# EAGLE design KGM LiPower v1.0 (EAGLE 5.11)
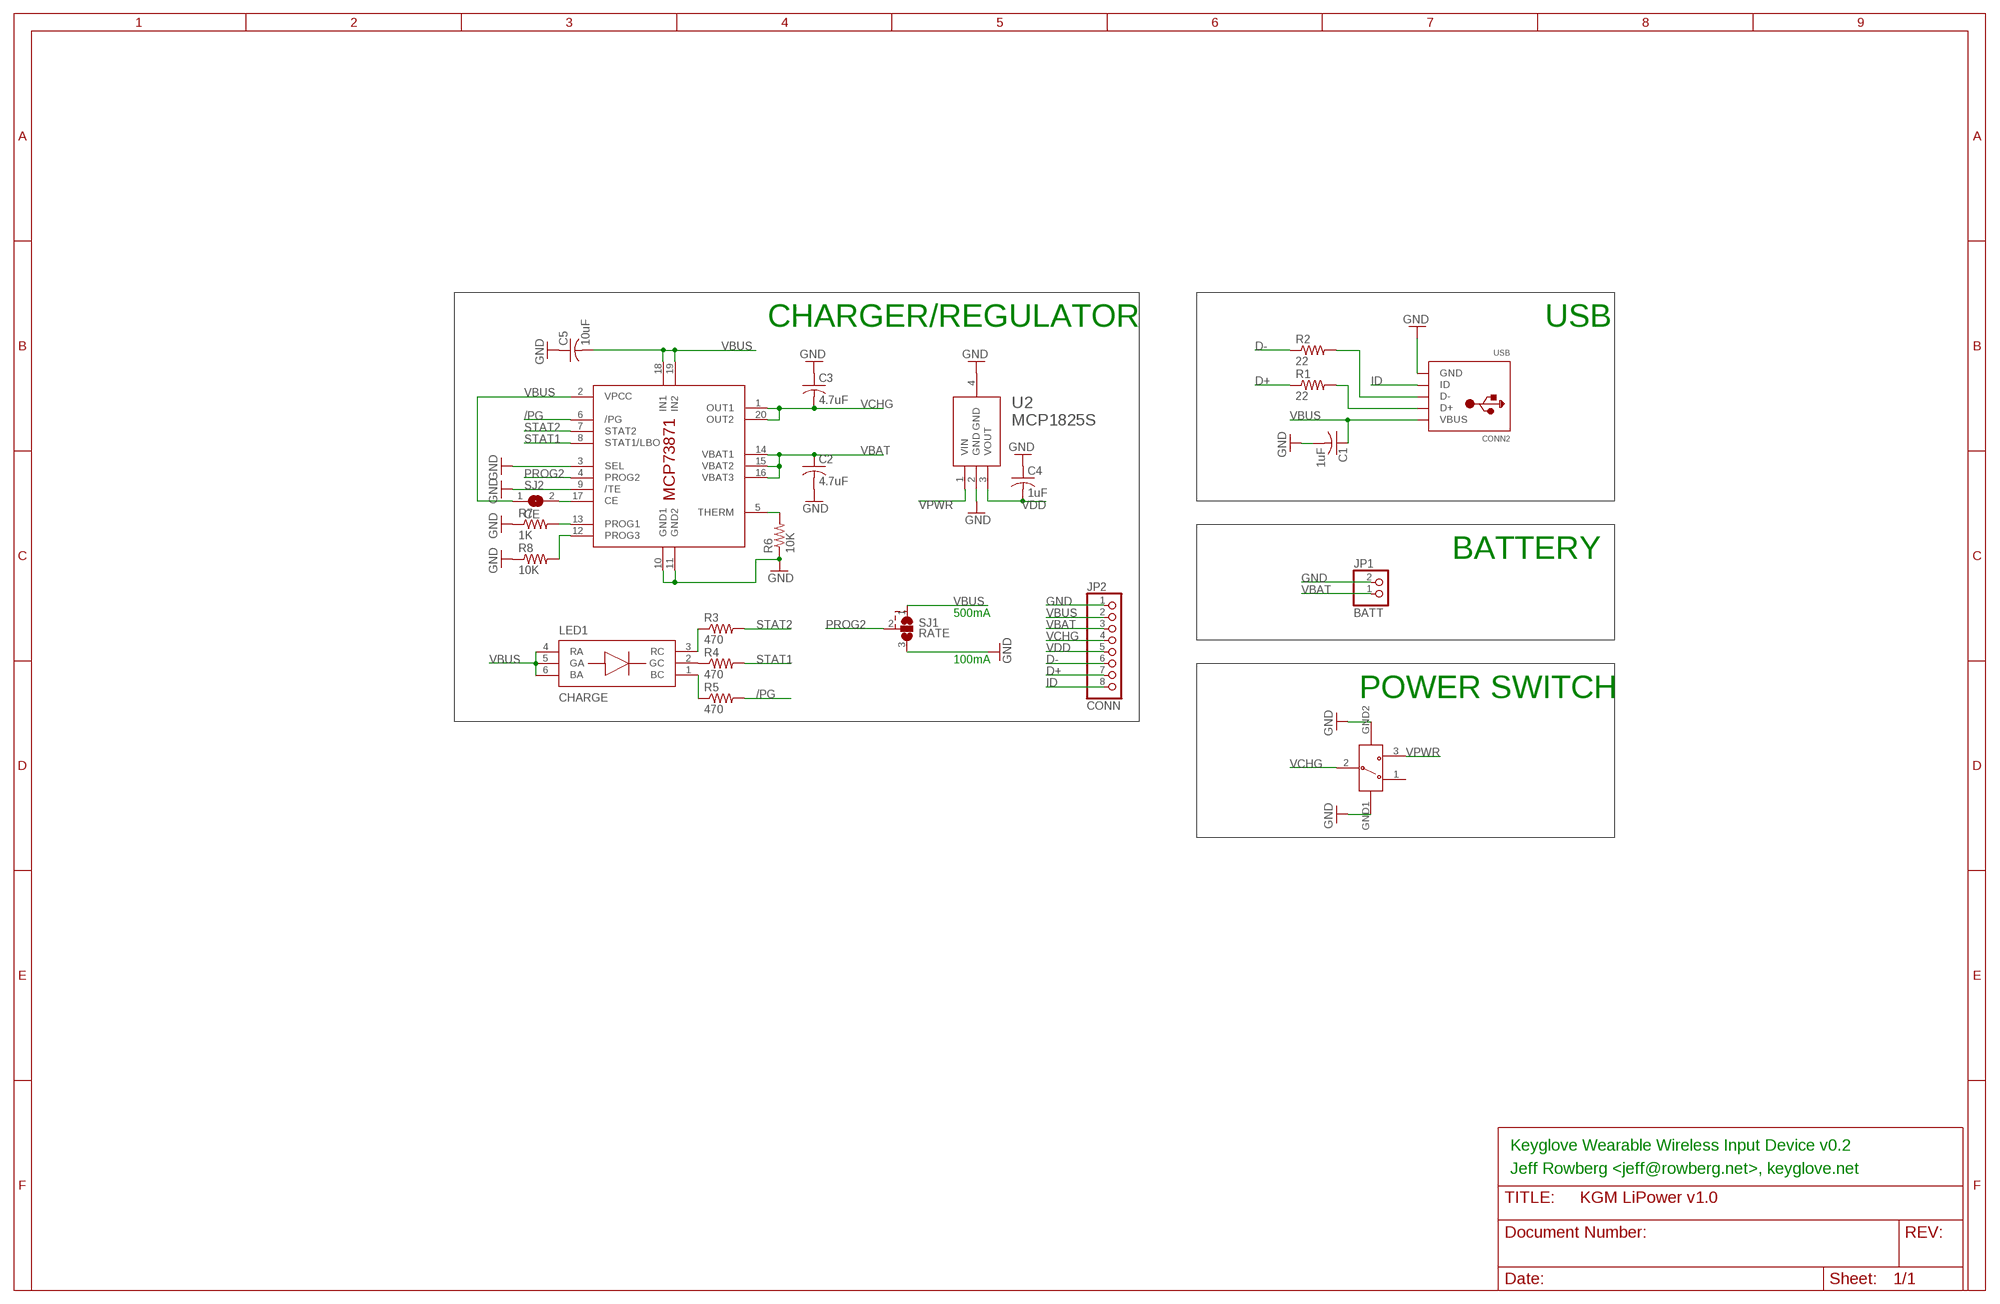
[diagram p0: schematic, sheet 1]

## Parts
C1  1uF  C-USC0603  [C0603]
C2  4.7uF  C-USC0603  [C0603]
C3  4.7uF  C-USC0603  [C0603]
C4  1uF  C-USC0603  [C0603]
C5  10uF  C-USC0603  [C0603]
CONN2  USB  USBMINIB  [USB-MINIB]
JP1  BATT  JST_2PIN-SMT-RA  [JST-PH-2-SMT-RA]
JP2  CONN  PINHD-1X8  [1X08]
LED1  CHARGE  ASMT-YTB2  [PLCC-6]
R1  22  R-US_R0603  [R0603]
R2  22  R-US_R0603  [R0603]
R3  470  R-US_R0603  [R0603]
R4  470  R-US_R0603  [R0603]
R5  470  R-US_R0603  [R0603]
R6  10K  R-US_R0603  [R0603]
R7  1K  R-US_R0603  [R0603]
R8  10K  R-US_R0603  [R0603]
SJ1  RATE  SJ2-TRACE  [SJ2-TRACE]
SJ2  CE  SJ  [SJ]
SW1  OS102011MA1QN1  [OS102011MA1QN1]
U1  MCP73871  [QFN20]
U2  MCP1825S  [SOT223]

## Nets
/PG: R5.2 U1.6(/PG)
D+: JP2.7 R1.1
D-: JP2.6 R2.1
GND [power]: C1.2 C2.2 C3.1 C4.1 C5.1 CONN2.GND JP1.2 JP2.1 R7.1 R8.1 SJ1.3 SW1.GND1(GND) SW1.GND2(GND) U1.3(SEL) U1.9(/TE) U2.2(GND) U2.4(GND)
ID: CONN2.ID JP2.8
N$1: SJ2.2 U1.17(CE)
N$6: R6.2 U1.5(THERM)
N$8: CONN2.D+ R1.2
N$9: CONN2.D- R2.2
N$11: R8.2 U1.12(PROG3)
N$12: LED1.2(GC) R4.1
N$13: LED1.3(RC) R3.1
N$14: LED1.1(BC) R5.1
PROG2: SJ1.2 U1.4(PROG2)
R6 [power]: R6.1 U1.10(GND1) U1.11(GND2) ; supply symbol labelled GND
R7: R7.2 U1.13(PROG1)
STAT1: R4.2 U1.8(STAT1/LBO)
STAT2: R3.2 U1.7(STAT2)
VBAT [power]: C2.1 JP1.1 JP2.3 U1.14(VBAT1) U1.15(VBAT2) U1.16(VBAT3)
VBUS [power]: C1.1 C5.2 CONN2.VBUS JP2.2 LED1.4(RA) LED1.5(GA) LED1.6(BA) SJ1.1 SJ2.1 U1.2(VPCC) U1.18(IN1) U1.19(IN2)
VCHG [power]: C3.2 JP2.4 SW1.2 U1.1(OUT1) U1.20(OUT2)
VDD [power]: C4.2 JP2.5 U2.3(VOUT)
VPWR: SW1.3 U2.1(VIN)
Unconnected: SW1.1

## Notes on the sheet
- CHARGER/REGULATOR | USB
- BATTERY
- 500mA
- 100mA
- POWER SWITCH
- Keyglove Wearable Wireless Input Device v0.2
- Jeff Rowberg <jeff@rowberg.net>, keyglove.net

## Library data of the parts
C1-C5 = resistor:C-US: CAPACITOR, American symbol
CONN2 = adafruit:USB: USB Connectors USBMINIB - Surface Mount Female Mini-B USB Connector 4UConnector: 06564 By microbuilder.eu Thru-hole RA Female Mini-B USB Connector 4UConnector: 18732 By ladyada.net
JP1 = adafruit:JST_2PIN: JST 2-Pin Connectors of various flavors SMT-RA (S2B-PH-SM4) 4UConnector #17311 SMT (B2B-PH-SM4) THM-RA (S2B-PH) THM (B2B-PH)
JP2 = sf-pinhead:PINHD-1X8: PIN HEADER
LED1 = sf-keyglove:ASMT-YTB2
R1-R8 = resistor:R-US_: RESISTOR, American symbol
SJ1 = sf-keyglove:SJ2-TRACE: SMD solder JUMPER
SJ2 = jumper:SJ: SMD solder JUMPER
SW1 = sf-keyglove:OS102011MA1QN1
U1 = adafruit:MCP73871
U2 = sf-keyglove:MCP1825S

## Net classes
0 default: width 0.152 mm, drill 0.305 mm, clearance 0.152 mm
1 power: width 0.254 mm, drill 0.305 mm, clearance 0.152 mm

## Board
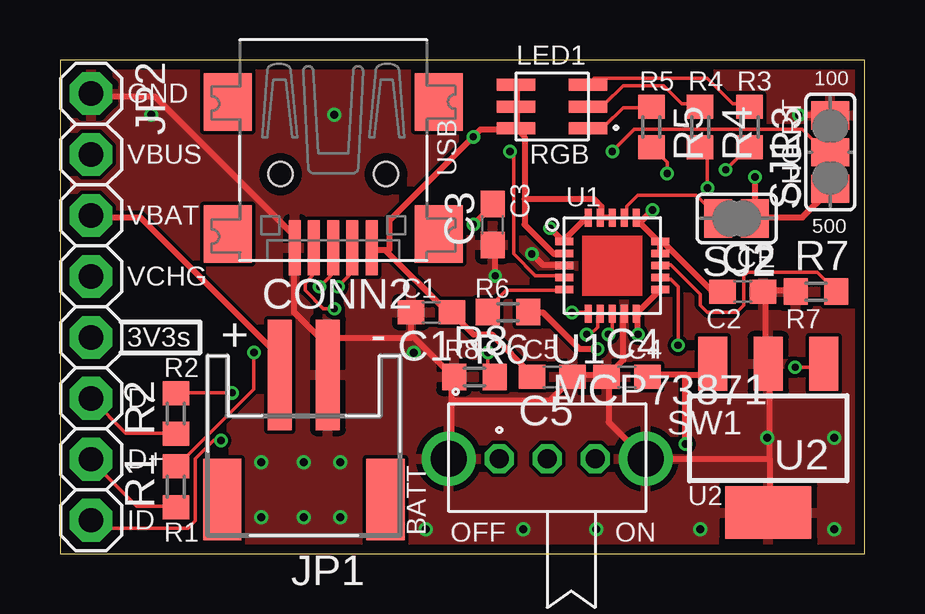
[diagram p1: board, top side]
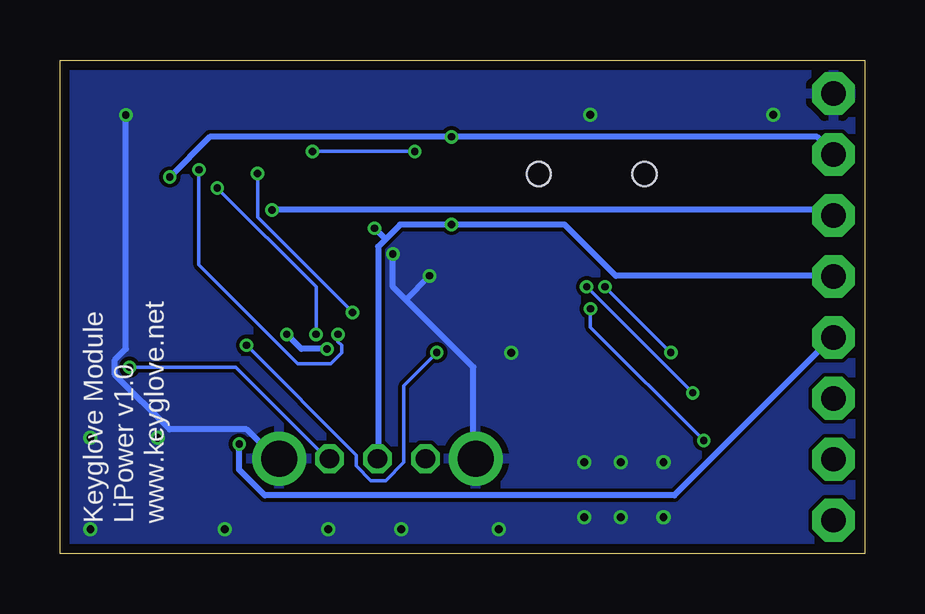
[diagram p2: board, bottom side, seen from below]

Size 33.53 x 20.57 mm. Coordinates in mm from the lower left corner, seen from the top.
Outline: 0,0 33.53,0 33.53,20.57 0,20.57 0,0
Copper layers (1*16): Top 0.0356mm / dielectric 1.5011mm / Bottom 0.0356mm
Design rules "PCBWingOrder *": minimum track width 6mil, minimum drill 12mil, track to track 6mil, track to pad 6mil, pad to pad 6mil, via to via 6mil, smd to smd 6mil, copper to edge 15mil, drill to drill 6mil, minimum pad ring 6mil, minimum via ring 5mil, stop-mask expansion 4mil, vias tented up to drill 20mil, thermal gap 10mil

### Footprints (pad centres in the part's own frame; a part is rotated, then mirrored left to right if it is on the bottom)
C0603 = smd 1.1 x 1: 1 -0.85,0; 2 0.85,0
USB-MINIB = smd 0.5 x 2.308: D+ 0,4.064; D- -0.8,4.064; GND 1.6,4.064; ID 0.8,4.064; VBUS -1.6,4.064 | smd 2 x 2.4: GND1 -4.4,-2; GND2 -4.4,3.5; GND3 4.4,3.5; GND4 4.4,-2 | hole 1: -2.2,1; 2.2,1
JST-PH-2-SMT-RA = smd 1 x 4.6: 1 1,-3.7; 2 -1,-3.7 | smd 1.6 x 3.4: NC1 -3.4,1.5; NC2 3.4,1.5
1X08 = drill 1.016 pad 1.778 octagon: 1 -8.89,0; 2 -6.35,0; 3 -3.81,0; 4 -1.27,0; 5 1.27,0; 6 3.81,0; 7 6.35,0; 8 8.89,0
PLCC-6 = smd 1.6 x 0.5: 1 1.5,-0.9; 2 1.5,0; 3 1.5,0.9; 4 -1.5,0.9; 5 -1.5,0; 6 -1.5,-0.9
R0603 = smd 1 x 1.1: 1 -0.85,0; 2 0.85,0
SJ2-TRACE = smd 1.168 x 1.6: 1 -1.524,0; 2 0,0; 3 1.524,0 | smd 0.762 x 0.152: TRACE -0.762,0
SJ = smd 1.168 x 1.6: 1 -0.762,0; 2 0.762,0
OS102011MA1QN1 = drill 0.8 octagon: 1 -2,0; 2 0,0; 3 2,0 | drill 1.5 round: GND1 -4.1,0; GND2 4.1,0
QFN20 = smd 0.75 x 0.3: 1 -2,1; 2 -2,0.5; 3 -2,0; 4 -2,-0.5; 5 -2,-1; 11 2,-1; 12 2,-0.5; 13 2,0; 14 2,0.5; 15 2,1 | smd 0.3 x 0.75: 6 -1,-2; 7 -0.5,-2; 8 0,-2; 9 0.5,-2; 10 1,-2; 16 1,2; 17 0.5,2; 18 0,2; 19 -0.5,2; 20 -1,2
SOT223 = smd 1.219 x 2.235: 1 -2.311,-3.099; 2 0,-3.099; 3 2.311,-3.099 | smd 3.6 x 2.2: 4 0,3.099

### Placement (x,y rotation side)
C1  15.48,10.07 180 top
C2  28.45,10.92 0 top
C3  18.03,13.72 90 top
C4  23.62,7.37 0 top
C5  20.51,7.37 180 top
CONN2  11.38,16.82 180 top
JP1  10.16,3.76 180 top
JP2  1.3,10.29 270 top
LED1  20.5,18.63 0 top
R1  4.83,2.79 90 top
R2  4.83,5.84 90 top
R3  28.73,17.78 270 top
R4  26.67,17.78 270 top
R5  24.64,17.78 270 top
R6  18.66,10.07 180 top
R7  31.5,10.92 0 top
R8  17.27,7.37 0 top
SJ1  32.09,16.74 90 top
SJ2  28.19,13.97 180 top
SW1  20.3,3.96 0 top
U1  23.02,12.01 0 top
U2  29.51,4.82 180 top

### Tracks (layer width: path | path; a pad name or v marks a point on that pad's centre or on a via)
/PG  (via drill 0.3)
  Top 0.152: v21.34,10.06 21.95,10.06 U1.6 | v25.3,15.85 25.3,16.31 24.69,16.92 R5.2
  Bottom 0.152: v21.34,10.06 25.3,14.02 v25.3,15.85
D+
  Top 0.152: R1.1 4.72,1.98 3.2,1.98 1.37,3.81 JP2.7
D-
  Top 0.152: R2.1 4.72,5.03 2.74,5.03 JP2.6
GND  (via drill 0.3, 0.33)
  Top 0.254: R7.1 30.63,10.97 29.41,10.97 C2.2 29.41,10.82 29.41,7.92 U2.2 29.57,7.77 29.57,3.96 | 29.57,3.96 29.57,1.83 U2.4 | U1.9 23.47,9.91 23.47,8.08 22.86,7.47 C4.1 | C4.1 22.71,7.47 21.49,7.47 C5.1 21.34,7.32 20.42,6.4 16.31,6.4 | v30.79,18.29 32,18.29 SJ1.3 | C4.1 22.86,7.32 22.86,5.49 24.38,3.96 SW1.GND2 24.54,3.96 29.57,3.96 | v19.66,12.5 20.12,12.04 20.88,12.04 U1.3 | 16.31,6.4 16.31,3.96 SW1.GND1 | 16.31,6.4 16.31,7.32 R8.1 16.31,7.47 14.71,9.07 | 14.71,9.07 14.63,9.14 14.63,10.06 C1.2 | v18.14,11.58 18.14,12.8 C3.1 | JP2.1 1.37,19.05 3.96,19.05 9.75,13.26 9.75,12.8 CONN2.GND 9.75,12.65 9.75,10.06 11.12,8.69 11.12,7.47 JP1.2 10.97,8.99 14.63,8.99 14.71,9.07
  Bottom 0.254: v30.79,18.29 30.79,8.53 31.24,8.08 31.24,7.47 28.96,5.18 25.76,5.18 24.54,3.96 SW1.GND2 | v19.66,12.5 19.66,11.12 19.13,10.59 | 19.13,10.59 16.31,7.77 16.31,3.96 SW1.GND1 | 19.13,10.59 v18.14,11.58
  other vias: 3.81,18.29 11.43,18.29 8.38,3.81 10.16,3.81 11.68,3.81 11.68,1.52 10.16,1.52 8.38,1.52 29.46,4.83 32.26,4.83 32.26,1.02 14.73,8.38 26.67,1.02 22.35,1.02 19.3,1.02 15.24,1.02
  pour Bottom: 0.25,20.32 33.27,20.32 33.27,0.25 0.25,0.25
  pour Top: 0.25,20.32 33.27,20.32 33.27,0.25 0.25,0.25
ID  (via drill 0.3)
  Top 0.152: v11.43,10.21 10.97,10.21 10.21,10.97 10.21,11.28 10.52,11.58 10.52,12.65 CONN2.ID | v6.71,4.72 6.4,4.72 5.64,3.96 5.64,1.37 5.33,1.07 1.68,1.07 1.37,1.37 JP2.8
  Bottom 0.152: v11.43,10.21 11.43,9.45 v6.71,4.72
N$1
  Top 0.152: U1.17 23.62,14.02 23.62,14.48 24.08,14.94 26.52,14.94 27.43,14.02 SJ2.2
N$6
  Top 0.152: U1.5 20.88,10.97 18.59,10.97 17.83,10.21 R6.2
N$8  (via drill 0.3)
  Top 0.152: v8.08,8.38 8.08,6.86 4.88,3.66 R1.2 | v10.82,11.12 11.28,11.58 11.28,12.65 CONN2.D+
  Bottom 0.152: v8.08,8.38 v10.82,11.12
N$9  (via drill 0.3)
  Top 0.152: v7.16,6.71 4.88,6.71 R2.2 | v11.58,11.12 12.04,11.58 12.04,12.65 CONN2.D-
  Bottom 0.152: v7.16,6.71 v11.58,11.12
N$11  (via drill 0.3)
  Top 0.152: v25.76,8.69 25.76,11.12 25.45,11.43 25.15,11.43 U1.12 | v17.83,8.38 17.83,7.62 17.98,7.47 R8.2
  Bottom 0.152: v25.76,8.69 21.18,4.12 21.18,3.66 20.57,3.05 19.96,3.05 19.2,3.81 19.2,7.01 v17.83,8.38
N$12
  Top 0.152: R4.1 26.67,18.75 25.91,18.75 25.15,19.51 23.47,19.51 22.71,18.75 22.1,18.75 LED1.2
N$13
  Top 0.152: R3.1 28.65,18.75 28.04,18.75 26.98,19.81 22.25,19.81 22.1,19.66 LED1.3
N$14
  Top 0.152: R5.1 24.54,18.59 23.47,18.59 22.71,17.83 22.1,17.83 LED1.1
PROG2  (via drill 0.3)
  Top 0.152: v18.75,16.76 18.9,16.61 18.9,12.5 19.81,11.58 20.88,11.58 U1.4 | v23.01,16.76 23.93,17.68 30.94,17.68 32,16.61 SJ1.2
  Bottom 0.152: v18.75,16.76 v23.01,16.76
R6  (via drill 0.3)
  Top 0.254: U1.11 24.99,10.97 24.08,10.06 U1.10 24.08,9.91 v24.08,9.14 | v22.4,8.53 21.64,8.53 20.12,10.06 19.66,10.06 R6.1
  Bottom 0.254: v22.4,8.53 23.47,8.53 v24.08,9.14
R7
  Top 0.152: U1.13 25.15,12.04 25.45,12.04 26.67,10.82 26.67,10.36 26.98,10.06 28.19,10.06 28.5,10.36 28.5,11.58 28.65,11.73 31.55,11.73 32.31,10.97 R7.2
STAT1  (via drill 0.3)
  Top 0.152: v22.86,9.14 23.01,9.3 23.01,9.91 U1.8 | v26.98,15.24 26.98,16.61 26.67,16.92 R4.2
  Bottom 0.152: v22.86,9.14 22.86,11.12 v26.98,15.24
STAT2  (via drill 0.3)
  Top 0.152: v21.95,9.14 22.1,9.14 22.4,9.45 22.4,9.91 U1.7 | v27.74,16 28.65,16.92 R3.2
  Bottom 0.152: v21.95,9.14 21.95,8.84 21.79,8.69 21.79,8.38 22.25,7.92 23.62,7.92 27.74,12.04 v27.74,16
VBAT  (via drill 0.3)
  Top 0.254: 24.99,12.95 24.99,12.65 U1.14 | 24.16,13.79 24.99,12.95 | 24.16,13.79 24.08,13.87 U1.16 | 24.99,12.95 U1.15 25.15,12.95 27.13,10.97 27.58,10.97 C2.1 | v24.69,14.33 24.16,13.79 | JP1.1 9.14,7.47 9.14,8.23 3.35,14.02 1.37,14.02 JP2.3
  Bottom 0.254: v24.69,14.33 1.52,14.33 JP2.3
VBUS  (via drill 0.3)
  Top 0.254: 22.55,14.02 23.01,14.02 U1.18 | 19.36,14.78 19.36,17.37 19.05,17.68 LED1.6 | 19.36,14.78 19.36,13.72 20.57,12.5 20.88,12.5 U1.2 | 22.55,14.02 22.55,14.48 22.25,14.78 19.36,14.78 | 22.55,14.02 U1.19 | LED1.6 19.05,17.83 19.05,18.59 LED1.5 19.05,18.75 19.05,19.51 LED1.4 | 13.64,12.57 13.56,12.65 13.11,12.65 CONN2.VBUS | 13.64,12.57 16,10.21 16.31,10.21 C1.1 16.31,10.06 17.22,9.14 17.98,9.14 19.66,7.47 C5.2 | LED1.6 18.9,17.68 17.53,17.68 v17.22,17.37 13.72,13.87 13.72,12.65 13.64,12.57 | 28.96,14.02 30.94,14.02 32,15.09 SJ1.1 | v28.96,15.7 28.96,14.02 | 28.96,14.02 SJ2.1
  Bottom 0.254: v28.96,15.7 27.28,17.37 v17.22,17.37 1.98,17.37 1.37,16.76 JP2.2
VCHG  (via drill 0.3)
  Top 0.254: U1.20 21.95,14.02 21.03,13.11 U1.1 20.88,13.11 v20.42,13.56 | v17.22,13.72 17.98,14.48 C3.2
  Bottom 0.254: 19.96,13.11 20.27,12.8 20.27,3.96 SW1.2 | 19.96,13.11 19.36,13.72 v17.22,13.72 12.5,13.72 10.36,11.58 1.37,11.58 JP2.4 | 19.96,13.11 v20.42,13.56
VDD  (via drill 0.3)
  Top 0.254: 26.06,7.47 26.82,7.47 27.13,7.77 U2.3 | 26.06,7.47 24.54,7.47 C4.2 | v26.06,4.57 26.06,7.47
  Bottom 0.254: v26.06,4.57 26.06,3.5 24.99,2.44 7.92,2.44 1.37,8.99 JP2.5
VPWR  (via drill 0.3)
  Top 0.152: v30.63,7.77 31.7,7.77 U2.1
  Bottom 0.152: v30.63,7.77 26.21,7.77 22.4,3.96 SW1.3

### Text on the board
tPlace: 100 | GND | R5 | R4 | R3 | CHG RT | VBUS | USB | RGB | VBAT | C3 | U1 | 500 | CE | VCHG | C1 | R6 | 3V3s | C2 | R7 | R8 | C5 | C4 | R2 | D- | D+ | U2 | ID | R1 | BATT | OFF | ON
bPlace: www.keyglove.net | LiPower v1.0 | Keyglove Module